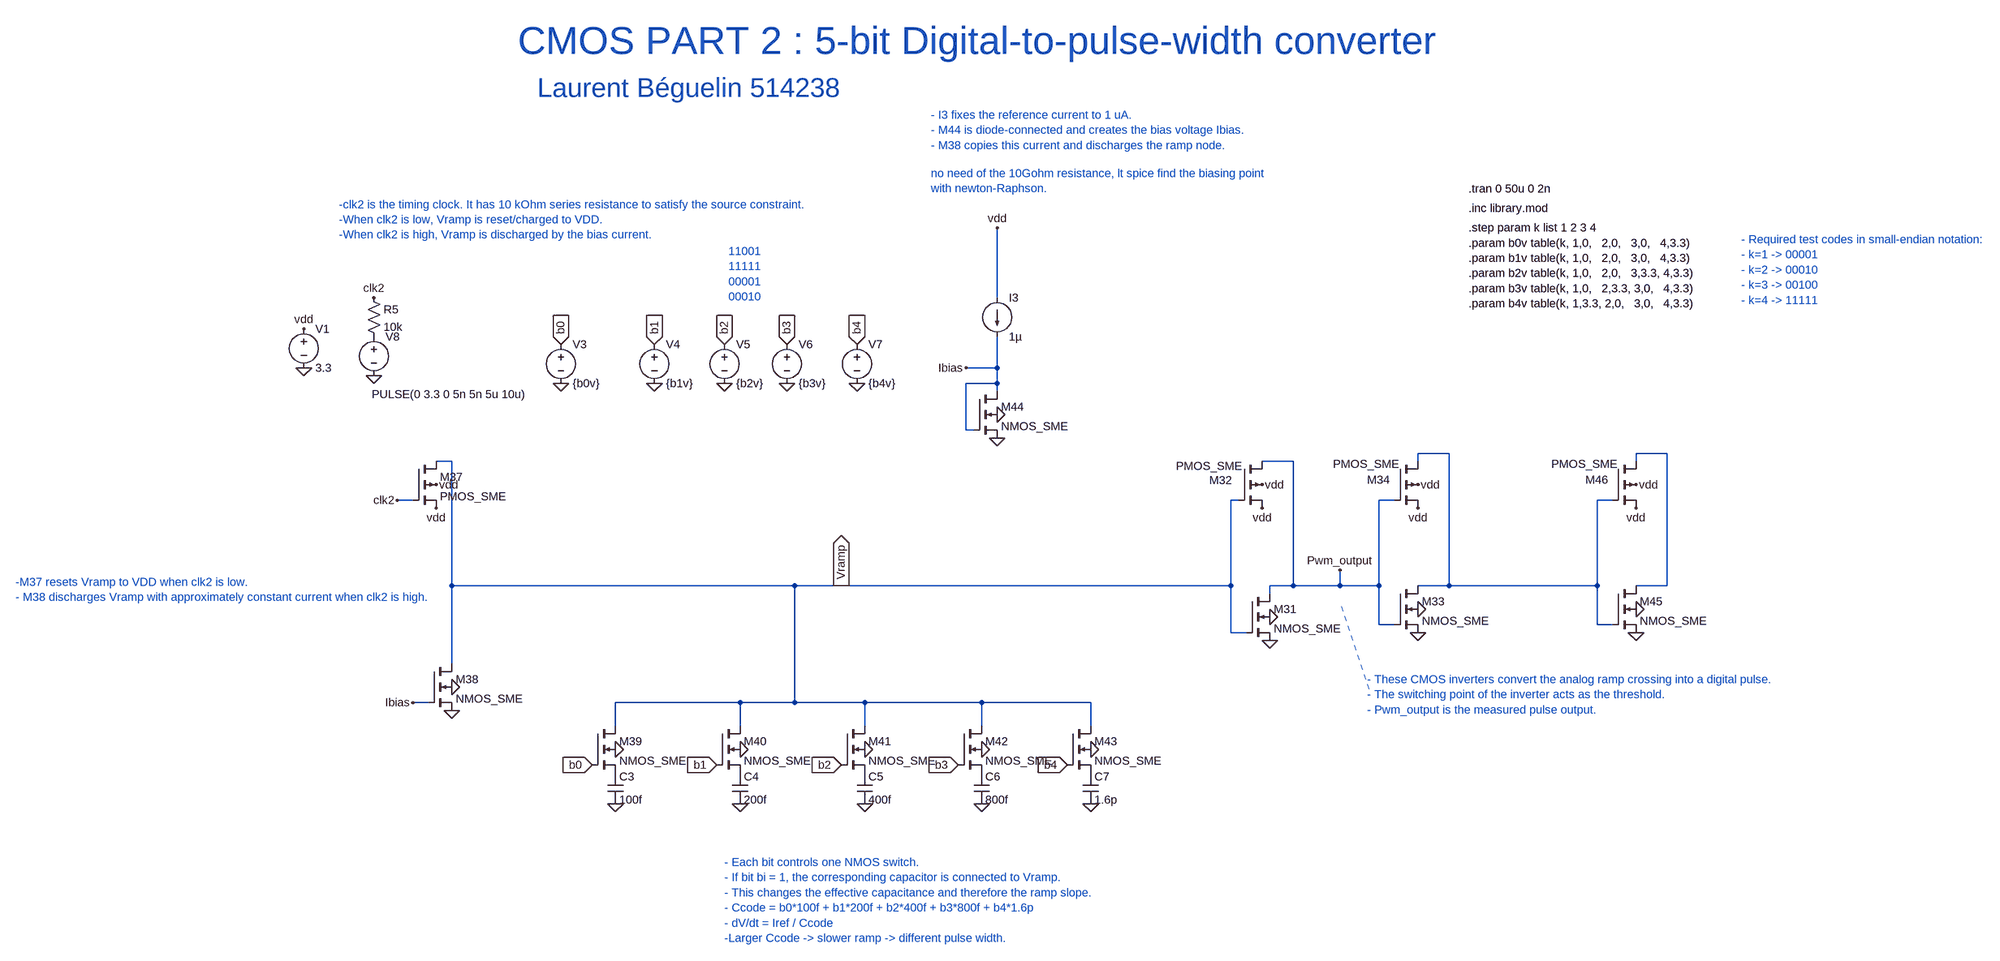
[diagram p0: schematic CMOS_Project_part2.asc]
CMOS_Project_part2.asc, the LTspice schematic file:
Version 4
SHEET 1 8820 1224
WIRE 6544 -304 6544 -448
WIRE 6544 -160 6544 -224
WIRE 6544 -160 6480 -160
WIRE 6544 -128 6544 -160
WIRE 6544 -128 6480 -128
WIRE 6544 -112 6544 -128
WIRE 6480 -32 6480 -128
WIRE 6496 -32 6480 -32
WIRE 7472 16 7408 16
WIRE 7920 16 7856 16
WIRE 5424 32 5392 32
WIRE 7152 32 7088 32
WIRE 7408 32 7408 16
WIRE 7856 32 7856 16
WIRE 5344 112 5312 112
WIRE 7040 112 7024 112
WIRE 7360 112 7328 112
WIRE 7808 112 7776 112
WIRE 5424 288 5424 32
WIRE 6128 288 5424 288
WIRE 6224 288 6128 288
WIRE 7024 288 7024 112
WIRE 7024 288 6224 288
WIRE 7152 288 7152 32
WIRE 7152 288 7104 288
WIRE 7248 288 7248 256
WIRE 7248 288 7152 288
WIRE 7328 288 7328 112
WIRE 7328 288 7248 288
WIRE 7472 288 7472 16
WIRE 7472 288 7408 288
WIRE 7776 288 7776 112
WIRE 7776 288 7472 288
WIRE 7920 288 7920 16
WIRE 7920 288 7856 288
WIRE 7104 304 7104 288
WIRE 7328 368 7328 288
WIRE 7360 368 7328 368
WIRE 7776 368 7776 288
WIRE 7808 368 7776 368
WIRE 7024 384 7024 288
WIRE 7056 384 7024 384
WIRE 5424 448 5424 288
WIRE 5376 528 5344 528
WIRE 6016 528 5760 528
WIRE 6128 528 6128 288
WIRE 6128 528 6016 528
WIRE 6272 528 6128 528
WIRE 6512 528 6272 528
WIRE 6736 528 6512 528
WIRE 5760 576 5760 528
WIRE 6016 576 6016 528
WIRE 6272 576 6272 528
WIRE 6512 576 6512 528
WIRE 6736 576 6736 528
FLAG 5120 -160 0
FLAG 5120 -240 vdd
FLAG 7104 400 0
FLAG 7104 352 0
FLAG 7408 384 0
FLAG 7408 336 0
FLAG 5392 80 vdd
FLAG 5424 544 0
FLAG 5424 496 0
FLAG 5760 624 0
FLAG 6016 624 0
FLAG 6272 624 0
FLAG 6512 624 0
FLAG 6736 624 0
FLAG 6736 736 0
FLAG 6512 736 0
FLAG 6272 736 0
FLAG 6016 736 0
FLAG 5760 736 0
FLAG 5648 -128 0
FLAG 5840 -128 0
FLAG 5984 -128 0
FLAG 6112 -128 0
FLAG 6256 -128 0
FLAG 5648 -208 b0
IOPIN 5648 -208 In
FLAG 5840 -208 b1
IOPIN 5840 -208 In
FLAG 5984 -208 b2
IOPIN 5984 -208 In
FLAG 6112 -208 b3
IOPIN 6112 -208 In
FLAG 6256 -208 b4
IOPIN 6256 -208 In
FLAG 5712 656 b0
IOPIN 5712 656 In
FLAG 5968 656 b1
IOPIN 5968 656 In
FLAG 6224 656 b2
IOPIN 6224 656 In
FLAG 6464 656 b3
IOPIN 6464 656 In
FLAG 6688 656 b4
IOPIN 6688 656 In
FLAG 5264 -144 0
FLAG 5264 -304 clk2
FLAG 5312 112 clk2
FLAG 5344 528 Ibias
FLAG 6224 288 Vramp
IOPIN 6224 288 Out
FLAG 6544 -448 vdd
FLAG 6544 -16 0
FLAG 6544 -64 0
FLAG 6480 -160 Ibias
FLAG 7408 80 vdd
FLAG 7088 80 vdd
FLAG 7088 128 vdd
FLAG 7408 128 vdd
FLAG 5392 128 vdd
FLAG 7856 384 0
FLAG 7856 336 0
FLAG 7856 80 vdd
FLAG 7856 128 vdd
FLAG 7248 256 Pwm_output
SYMBOL voltage 5120 -256 R0
WINDOW 123 0 0 Left 0
WINDOW 39 0 0 Left 0
SYMATTR InstName V1
SYMATTR Value 3.3
SYMBOL nmos4 7056 304 R0
SYMATTR InstName M31
SYMATTR Value NMOS_SME
SYMATTR Value2 l=0.35u w=0.4u
SYMBOL nmos4 7360 288 R0
SYMATTR InstName M33
SYMATTR Value NMOS_SME
SYMATTR Value2 l=0.35u w=0.4u
SYMBOL pmos4 5344 32 R0
SYMATTR InstName M37
SYMATTR Value PMOS_SME
SYMATTR Value2 l=0.35u w=0.4u
SYMBOL nmos4 5376 448 R0
SYMATTR InstName M38
SYMATTR Value NMOS_SME
SYMATTR Value2 l=0.35u w=5u
SYMBOL nmos4 5712 576 R0
SYMATTR InstName M39
SYMATTR Value NMOS_SME
SYMATTR Value2 l=0.35u w=0.4u
SYMBOL nmos4 5968 576 R0
SYMATTR InstName M40
SYMATTR Value NMOS_SME
SYMATTR Value2 l=0.35u w=0.4u
SYMBOL nmos4 6224 576 R0
SYMATTR InstName M41
SYMATTR Value NMOS_SME
SYMATTR Value2 l=0.35u w=0.4u
SYMBOL nmos4 6464 576 R0
SYMATTR InstName M42
SYMATTR Value NMOS_SME
SYMATTR Value2 l=0.35u w=0.4u
SYMBOL nmos4 6688 576 R0
SYMATTR InstName M43
SYMATTR Value NMOS_SME
SYMATTR Value2 l=0.35u w=0.4u
SYMBOL Cap 5744 672 R0
SYMATTR InstName C3
SYMATTR Value 100f
SYMBOL Cap 6000 672 R0
SYMATTR InstName C4
SYMATTR Value 200f
SYMBOL Cap 6256 672 R0
SYMATTR InstName C5
SYMATTR Value 400f
SYMBOL Cap 6496 672 R0
SYMATTR InstName C6
SYMATTR Value 800f
SYMBOL Cap 6720 672 R0
SYMATTR InstName C7
SYMATTR Value 1.6p
SYMBOL Voltage 5648 -224 R0
SYMATTR InstName V3
SYMATTR Value {b0v}
SYMATTR SpiceLine Rser=10k
SYMBOL Voltage 5840 -224 R0
SYMATTR InstName V4
SYMATTR Value {b1v}
SYMATTR SpiceLine Rser=10k
SYMBOL Voltage 5984 -224 R0
SYMATTR InstName V5
SYMATTR Value {b2v}
SYMATTR SpiceLine Rser=10k
SYMBOL Voltage 6112 -224 R0
SYMATTR InstName V6
SYMATTR Value {b3v}
SYMATTR SpiceLine Rser=10k
SYMBOL Voltage 6256 -224 R0
SYMATTR InstName V7
SYMATTR Value {b4v}
SYMATTR SpiceLine Rser=10k
SYMBOL current 6544 -304 R0
WINDOW 123 0 0 Left 0
WINDOW 39 0 0 Left 0
SYMATTR InstName I3
SYMATTR Value 1µ
SYMBOL voltage 5264 -240 R0
WINDOW 123 0 0 Left 0
WINDOW 39 0 0 Left 0
WINDOW 3 -4 134 Left 2
SYMATTR Value PULSE(0 3.3 0 5n 5n 5u 10u)
SYMATTR InstName V8
SYMBOL Res 5248 -320 R0
SYMATTR InstName R5
SYMATTR Value 10k
SYMBOL nmos4 6496 -112 R0
SYMATTR InstName M44
SYMATTR Value NMOS_SME
SYMATTR Value2 l=0.35u w=5u
SYMBOL pmos4 7040 32 R0
WINDOW 0 -60 39 Left 2
WINDOW 3 -129 10 Left 2
SYMATTR InstName M32
SYMATTR Value PMOS_SME
SYMATTR Value2 l=0.35u w=0.4u
SYMBOL pmos4 7360 32 R0
WINDOW 0 -56 38 Left 2
WINDOW 3 -126 6 Left 2
SYMATTR InstName M34
SYMATTR Value PMOS_SME
SYMATTR Value2 l=0.35u w=0.4u
SYMBOL nmos4 7808 288 R0
SYMATTR InstName M45
SYMATTR Value NMOS_SME
SYMATTR Value2 l=0.35u w=0.4u
SYMBOL pmos4 7808 32 R0
WINDOW 0 -56 38 Left 2
WINDOW 3 -126 6 Left 2
SYMATTR InstName M46
SYMATTR Value PMOS_SME
SYMATTR Value2 l=0.35u w=0.8u
TEXT 7512 -488 Left 2 !.inc library.mod
TEXT 7512 -528 Left 2 !.tran 0 50u 0 2n
TEXT 5992 -400 Left 2 ;11001\n11111\n00001\n00010
TEXT 5560 -832 Left 6 ;CMOS PART 2 : 5-bit Digital-to-pulse-width converter
TEXT 5600 -736 Left 5 ;Laurent Béguelin 514238
TEXT 7512 -448 Left 2 !.step param k list 1 2 3 4\n.param b0v table(k, 1,0,   2,0,   3,0,   4,3.3)\n.param b1v table(k, 1,0,   2,0,   3,0,   4,3.3)\n.param b2v table(k, 1,0,   2,0,   3,3.3, 4,3.3)\n.param b3v table(k, 1,0,   2,3.3, 3,0,   4,3.3)\n.param b4v table(k, 1,3.3, 2,0,   3,0,   4,3.3)
TEXT 6408 -560 Left 2 ;no need of the 10Gohm resistance, lt spice find the biasing point \nwith newton-Raphson.
TEXT 5192 -496 Left 2 ;-clk2 is the timing clock. It has 10 kOhm series resistance to satisfy the source constraint.\n-When clk2 is low, Vramp is reset/charged to VDD.\n-When clk2 is high, Vramp is discharged by the bias current.
TEXT 4528 280 Left 2 ;-M37 resets Vramp to VDD when clk2 is low.\n- M38 discharges Vramp with approximately constant current when clk2 is high.
TEXT 5984 856 Left 2 ;- Each bit controls one NMOS switch.\n- If bit bi = 1, the corresponding capacitor is connected to Vramp.\n- This changes the effective capacitance and therefore the ramp slope.\n- Ccode = b0*100f + b1*200f + b2*400f + b3*800f + b4*1.6p\n- dV/dt = Iref / Ccode\n-Larger Ccode -> slower ramp -> different pulse width.
TEXT 6408 -680 Left 2 ;- I3 fixes the reference current to 1 uA.\n- M44 is diode-connected and creates the bias voltage Ibias.\n- M38 copies this current and discharges the ramp node.
TEXT 8072 -424 Left 2 ;- Required test codes in small-endian notation:\n- k=1 -> 00001\n- k=2 -> 00010\n- k=3 -> 00100\n- k=4 -> 11111
TEXT 7304 480 Left 2 ;- These CMOS inverters convert the analog ramp crossing into a digital pulse.\n- The switching point of the inverter acts as the threshold.\n- Pwm_output is the measured pulse output.
LINE Normal 7308 500 7248 320 2

The netlist it stands for:
* CMOS_Project_part2.asc
V1 vdd 0 3.3
M31 Pwm_output Vramp 0 0 NMOS_SME l=0.35u w=0.4u
M33 N001 Pwm_output 0 0 NMOS_SME l=0.35u w=0.4u
M37 Vramp clk2 vdd vdd PMOS_SME l=0.35u w=0.4u
M38 Vramp Ibias 0 0 NMOS_SME l=0.35u w=5u
M39 Vramp b0 P001 0 NMOS_SME l=0.35u w=0.4u
M40 Vramp b1 P002 0 NMOS_SME l=0.35u w=0.4u
M41 Vramp b2 P003 0 NMOS_SME l=0.35u w=0.4u
M42 Vramp b3 P004 0 NMOS_SME l=0.35u w=0.4u
M43 Vramp b4 P005 0 NMOS_SME l=0.35u w=0.4u
C3 P001 0 100f
C4 P002 0 200f
C5 P003 0 400f
C6 P004 0 800f
C7 P005 0 1.6p
V3 b0 0 {b0v} Rser=10k
V4 b1 0 {b1v} Rser=10k
V5 b2 0 {b2v} Rser=10k
V6 b3 0 {b3v} Rser=10k
V7 b4 0 {b4v} Rser=10k
I3 vdd Ibias 1µ
V8 P006 0 PULSE(0 3.3 0 5n 5n 5u 10u)
R5 clk2 P006 10k
M44 Ibias Ibias 0 0 NMOS_SME l=0.35u w=5u
M32 Pwm_output Vramp vdd vdd PMOS_SME l=0.35u w=0.4u
M34 N001 Pwm_output vdd vdd PMOS_SME l=0.35u w=0.4u
M45 N002 N001 0 0 NMOS_SME l=0.35u w=0.4u
M46 N002 N001 vdd vdd PMOS_SME l=0.35u w=0.8u
.model NMOS NMOS
.model PMOS PMOS
.lib standard.mos
.inc library.mod
.tran 0 50u 0 2n
* 11001
* 11111
* 00001
* 00010
* CMOS PART 2 : 5-bit Digital-to-pulse-width converter
* Laurent Béguelin 514238
.step param k list 1 2 3 4
.param b0v table(k, 1,0,   2,0,   3,0,   4,3.3)
.param b1v table(k, 1,0,   2,0,   3,0,   4,3.3)
.param b2v table(k, 1,0,   2,0,   3,3.3, 4,3.3)
.param b3v table(k, 1,0,   2,3.3, 3,0,   4,3.3)
.param b4v table(k, 1,3.3, 2,0,   3,0,   4,3.3)
* no need of the 10Gohm resistance, lt spice find the biasing point
* with newton-Raphson.
* -clk2 is the timing clock. It has 10 kOhm series resistance to satisfy the source constraint.
* -When clk2 is low, Vramp is reset/charged to VDD.
* -When clk2 is high, Vramp is discharged by the bias current.
* -M37 resets Vramp to VDD when clk2 is low.
* - M38 discharges Vramp with approximately constant current when clk2 is high.
* - Each bit controls one NMOS switch.
* - If bit bi = 1, the corresponding capacitor is connected to Vramp.
* - This changes the effective capacitance and therefore the ramp slope.
* - Ccode = b0*100f + b1*200f + b2*400f + b3*800f + b4*1.6p
* - dV/dt = Iref / Ccode
* -Larger Ccode -> slower ramp -> different pulse width.
* - I3 fixes the reference current to 1 uA.
* - M44 is diode-connected and creates the bias voltage Ibias.
* - M38 copies this current and discharges the ramp node.
* - Required test codes in small-endian notation:
* - k=1 -> 00001
* - k=2 -> 00010
* - k=3 -> 00100
* - k=4 -> 11111
* - These CMOS inverters convert the analog ramp crossing into a digital pulse.
* - The switching point of the inverter acts as the threshold.
* - Pwm_output is the measured pulse output.
.backanno
.end